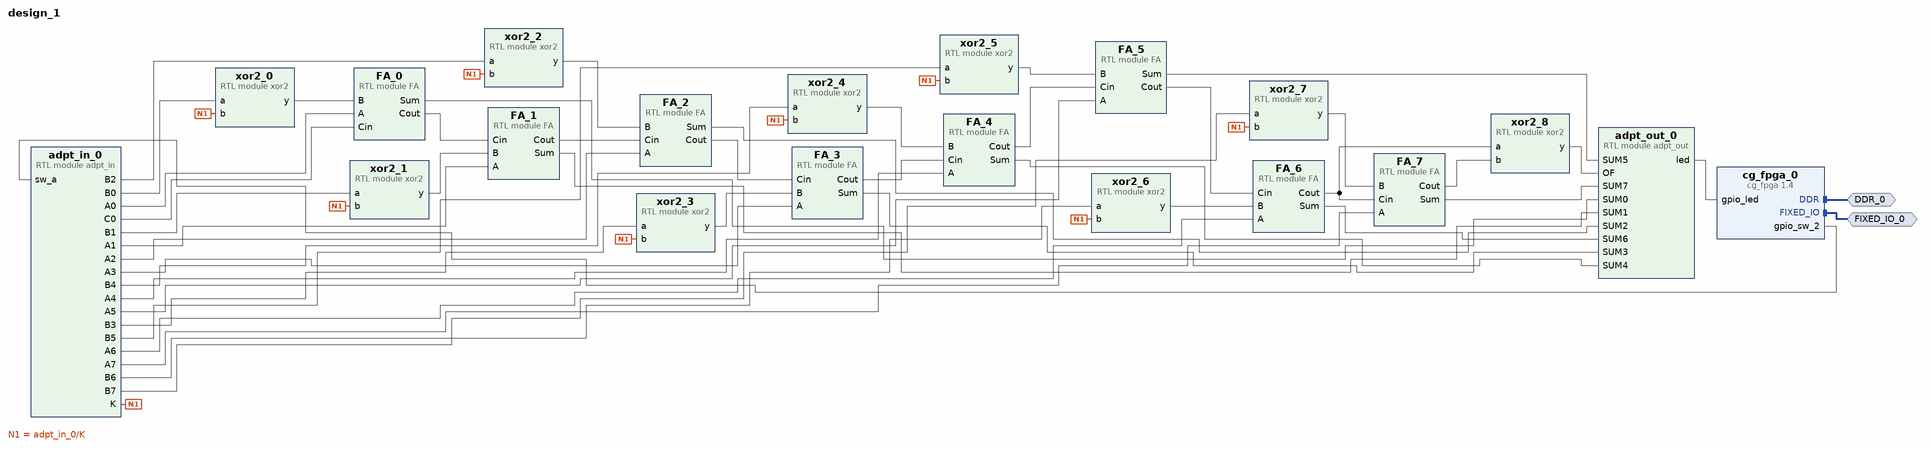
[diagram p0: block diagram of the top level]
# Vivado block design design_1, xc7z020clg400-1, Vivado 2024.2
create_bd_design design_1

create_bd_intf_port -mode Master -vlnv xilinx.com:display_processing_system7:fixedio_rtl:1.0 FIXED_IO_0
create_bd_intf_port -mode Master -vlnv xilinx.com:interface:ddrx_rtl:1.0 DDR_0

create_bd_cell -type ip -vlnv educg.net:user:cg_fpga:1.4 cg_fpga_0
create_bd_cell -type module -reference adpt_in adpt_in_0
create_bd_cell -type module -reference FA FA_0
create_bd_cell -type module -reference xor2 xor2_0
create_bd_cell -type module -reference xor2 xor2_1
create_bd_cell -type module -reference xor2 xor2_2
create_bd_cell -type module -reference xor2 xor2_3
create_bd_cell -type module -reference xor2 xor2_4
create_bd_cell -type module -reference xor2 xor2_5
create_bd_cell -type module -reference xor2 xor2_6
create_bd_cell -type module -reference xor2 xor2_7
create_bd_cell -type module -reference adpt_out adpt_out_0
create_bd_cell -type module -reference FA FA_1
create_bd_cell -type module -reference FA FA_2
create_bd_cell -type module -reference FA FA_3
create_bd_cell -type module -reference FA FA_4
create_bd_cell -type module -reference FA FA_5
create_bd_cell -type module -reference FA FA_6
create_bd_cell -type module -reference FA FA_7
create_bd_cell -type module -reference xor2 xor2_8

# ---- connections ----

connect_bd_intf_net [get_bd_intf_ports DDR_0] [get_bd_intf_pins cg_fpga_0/DDR]
connect_bd_intf_net [get_bd_intf_ports FIXED_IO_0] [get_bd_intf_pins cg_fpga_0/FIXED_IO]
connect_bd_net [get_bd_pins FA_0/Cout] [get_bd_pins FA_1/Cin]
connect_bd_net [get_bd_pins FA_0/Sum] [get_bd_pins adpt_out_0/SUM0]
connect_bd_net [get_bd_pins FA_1/Cout] [get_bd_pins FA_2/Cin]
connect_bd_net [get_bd_pins FA_1/Sum] [get_bd_pins adpt_out_0/SUM1]
connect_bd_net [get_bd_pins FA_2/Cout] [get_bd_pins FA_3/Cin]
connect_bd_net [get_bd_pins FA_2/Sum] [get_bd_pins adpt_out_0/SUM2]
connect_bd_net [get_bd_pins FA_3/Cout] [get_bd_pins FA_4/Cin]
connect_bd_net [get_bd_pins FA_3/Sum] [get_bd_pins adpt_out_0/SUM3]
connect_bd_net [get_bd_pins FA_4/Cout] [get_bd_pins FA_5/Cin]
connect_bd_net [get_bd_pins FA_4/Sum] [get_bd_pins adpt_out_0/SUM4]
connect_bd_net [get_bd_pins FA_5/Cout] [get_bd_pins FA_6/Cin]
connect_bd_net [get_bd_pins FA_5/Sum] [get_bd_pins adpt_out_0/SUM5]
connect_bd_net [get_bd_pins FA_6/Cout] [get_bd_pins FA_7/Cin] [get_bd_pins xor2_8/a]
connect_bd_net [get_bd_pins FA_6/Sum] [get_bd_pins adpt_out_0/SUM6]
connect_bd_net [get_bd_pins FA_7/Cout] [get_bd_pins xor2_8/b]
connect_bd_net [get_bd_pins FA_7/Sum] [get_bd_pins adpt_out_0/SUM7]
connect_bd_net [get_bd_pins adpt_in_0/A0] [get_bd_pins FA_0/A]
connect_bd_net [get_bd_pins adpt_in_0/A1] [get_bd_pins FA_1/A]
connect_bd_net [get_bd_pins adpt_in_0/A2] [get_bd_pins FA_2/A]
connect_bd_net [get_bd_pins adpt_in_0/A3] [get_bd_pins FA_3/A]
connect_bd_net [get_bd_pins adpt_in_0/A4] [get_bd_pins FA_4/A]
connect_bd_net [get_bd_pins adpt_in_0/A5] [get_bd_pins FA_5/A]
connect_bd_net [get_bd_pins adpt_in_0/A6] [get_bd_pins FA_6/A]
connect_bd_net [get_bd_pins adpt_in_0/A7] [get_bd_pins FA_7/A]
connect_bd_net [get_bd_pins adpt_in_0/B0] [get_bd_pins xor2_0/a]
connect_bd_net [get_bd_pins adpt_in_0/B1] [get_bd_pins xor2_1/a]
connect_bd_net [get_bd_pins adpt_in_0/B2] [get_bd_pins xor2_2/a]
connect_bd_net [get_bd_pins adpt_in_0/B3] [get_bd_pins xor2_3/a]
connect_bd_net [get_bd_pins adpt_in_0/B4] [get_bd_pins xor2_4/a]
connect_bd_net [get_bd_pins adpt_in_0/B5] [get_bd_pins xor2_5/a]
connect_bd_net [get_bd_pins adpt_in_0/B6] [get_bd_pins xor2_6/a]
connect_bd_net [get_bd_pins adpt_in_0/B7] [get_bd_pins xor2_7/a]
connect_bd_net [get_bd_pins adpt_in_0/C0] [get_bd_pins FA_0/Cin]
connect_bd_net [get_bd_pins adpt_in_0/K] \
  [get_bd_pins xor2_0/b] [get_bd_pins xor2_1/b] [get_bd_pins xor2_2/b] [get_bd_pins xor2_3/b] [get_bd_pins xor2_7/b] \
  [get_bd_pins xor2_6/b] [get_bd_pins xor2_5/b] [get_bd_pins xor2_4/b]
connect_bd_net [get_bd_pins adpt_out_0/led] [get_bd_pins cg_fpga_0/gpio_led]
connect_bd_net [get_bd_pins cg_fpga_0/gpio_sw_2] [get_bd_pins adpt_in_0/sw_a]
connect_bd_net [get_bd_pins xor2_0/y] [get_bd_pins FA_0/B]
connect_bd_net [get_bd_pins xor2_1/y] [get_bd_pins FA_1/B]
connect_bd_net [get_bd_pins xor2_2/y] [get_bd_pins FA_2/B]
connect_bd_net [get_bd_pins xor2_3/y] [get_bd_pins FA_3/B]
connect_bd_net [get_bd_pins xor2_4/y] [get_bd_pins FA_4/B]
connect_bd_net [get_bd_pins xor2_5/y] [get_bd_pins FA_5/B]
connect_bd_net [get_bd_pins xor2_6/y] [get_bd_pins FA_6/B]
connect_bd_net [get_bd_pins xor2_7/y] [get_bd_pins FA_7/B]
connect_bd_net [get_bd_pins xor2_8/y] [get_bd_pins adpt_out_0/OF]

validate_bd_design
save_bd_design
